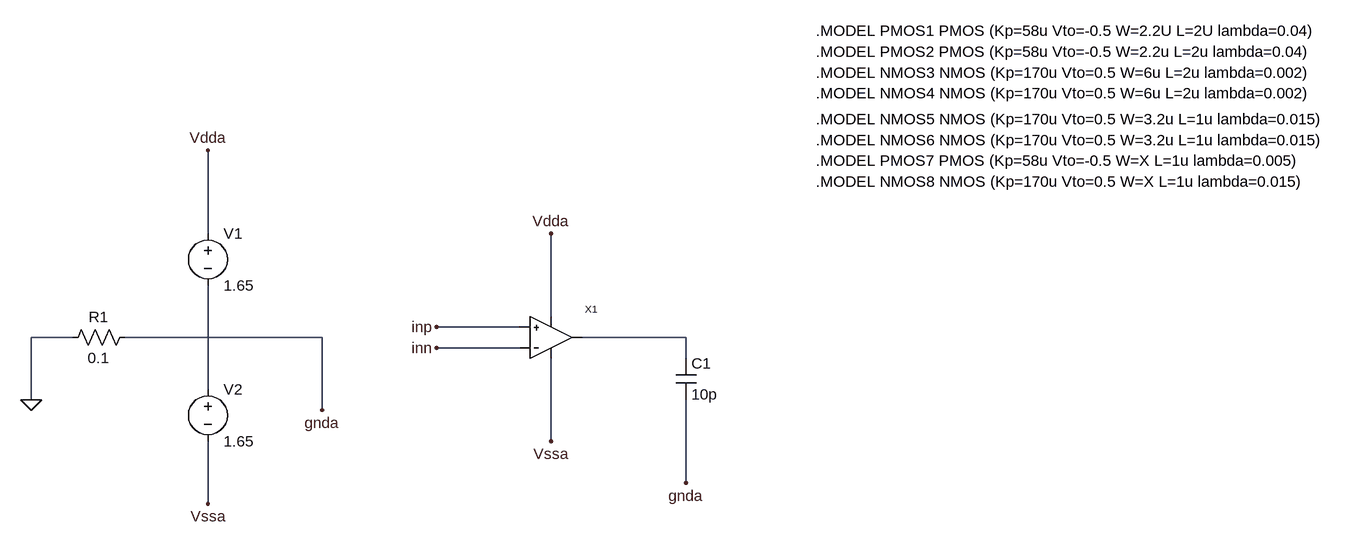
[diagram p0: schematic CMOSopamp-top.asc]
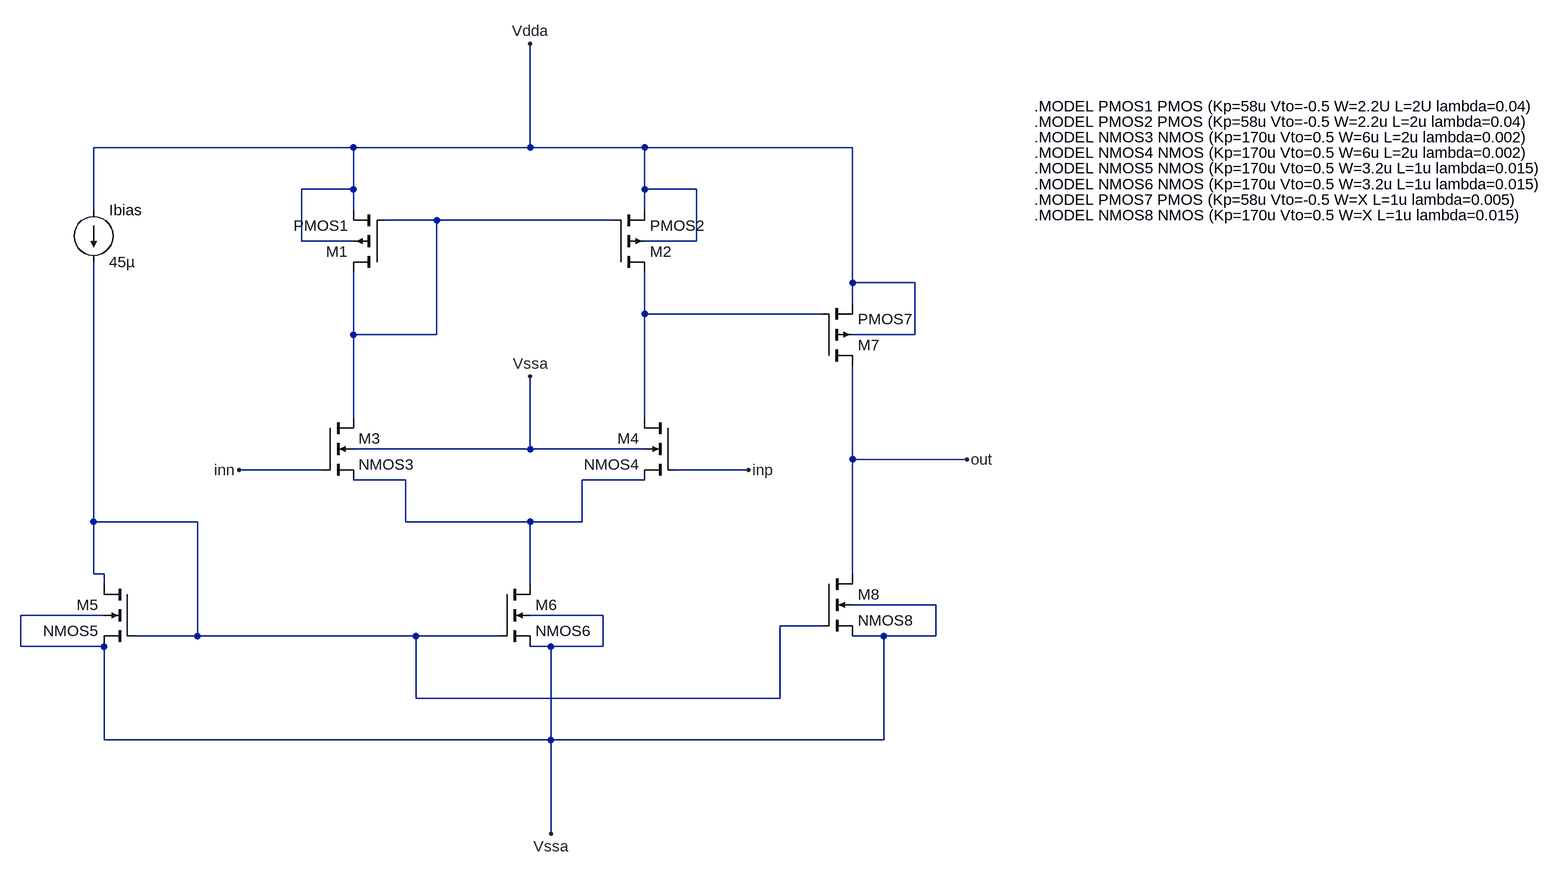
[diagram p1: sub-circuit cmosopamp.asc]
CMOSopamp-top.asc, the LTspice schematic file:
Version 4
SHEET 1 1892 680
WIRE 112 80 112 -48
WIRE 640 208 640 80
WIRE 592 224 464 224
WIRE -96 240 -160 240
WIRE 288 240 -16 240
WIRE 848 240 688 240
WIRE 592 256 464 256
WIRE 848 272 848 240
WIRE 112 320 112 160
WIRE -160 336 -160 240
WIRE 288 352 288 240
WIRE 640 400 640 272
WIRE 848 464 848 336
WIRE 112 496 112 400
FLAG -160 336 0
FLAG 288 352 gnda
FLAG 112 496 Vssa
FLAG 112 -48 Vdda
FLAG 640 80 Vdda
FLAG 464 224 inp
FLAG 464 256 inn
FLAG 640 400 Vssa
FLAG 848 464 gnda
SYMBOL voltage 112 64 R0
WINDOW 123 0 0 Left 0
WINDOW 39 0 0 Left 0
SYMATTR InstName V1
SYMATTR Value 1.65
SYMBOL voltage 112 304 R0
WINDOW 123 0 0 Left 0
WINDOW 39 0 0 Left 0
SYMATTR InstName V2
SYMATTR Value 1.65
SYMBOL res 0 224 R90
WINDOW 0 0 56 VBottom 2
WINDOW 3 32 56 VTop 2
SYMATTR InstName R1
SYMATTR Value 0.1
SYMBOL CMOSopamp 640 256 R0
SYMATTR InstName X1
SYMBOL cap 832 272 R0
SYMATTR InstName C1
SYMATTR Value 10p
TEXT 1048 -96 Left 2 !.MODEL NMOS5 NMOS (Kp=170u Vto=0.5 W=3.2u L=1u lambda=0.015)
TEXT 1048 -232 Left 2 !.MODEL PMOS1 PMOS (Kp=58u Vto=-0.5 W=2.2U L=2U lambda=0.04)
TEXT 1048 -168 Left 2 !.MODEL NMOS3 NMOS (Kp=170u Vto=0.5 W=6u L=2u lambda=0.002)
TEXT 1048 -200 Left 2 !.MODEL PMOS2 PMOS (Kp=58u Vto=-0.5 W=2.2u L=2u lambda=0.04)
TEXT 1048 -136 Left 2 !.MODEL NMOS4 NMOS (Kp=170u Vto=0.5 W=6u L=2u lambda=0.002)
TEXT 1048 -64 Left 2 !.MODEL NMOS6 NMOS (Kp=170u Vto=0.5 W=3.2u L=1u lambda=0.015)
TEXT 1048 -32 Left 2 !.MODEL PMOS7 PMOS (Kp=58u Vto=-0.5 W=X L=1u lambda=0.005)
TEXT 1048 0 Left 2 !.MODEL NMOS8 NMOS (Kp=170u Vto=0.5 W=X L=1u lambda=0.015)

cmosopamp.asc, the sub-circuit schematic file:
Version 4
SHEET 1 2232 836
WIRE -80 -320 -480 -320
WIRE 192 -320 192 -480
WIRE 192 -320 -80 -320
WIRE 368 -320 192 -320
WIRE 688 -320 368 -320
WIRE -80 -256 -80 -320
WIRE -80 -256 -160 -256
WIRE 368 -256 368 -320
WIRE 448 -256 368 -256
WIRE -480 -224 -480 -320
WIRE -80 -224 -80 -256
WIRE 368 -224 368 -256
WIRE 48 -208 -32 -208
WIRE 320 -208 48 -208
WIRE -160 -176 -160 -256
WIRE -80 -176 -160 -176
WIRE 448 -176 448 -256
WIRE 448 -176 368 -176
WIRE 688 -112 688 -320
WIRE 784 -112 688 -112
WIRE 688 -80 688 -112
WIRE 368 -64 368 -128
WIRE 640 -64 368 -64
WIRE -80 -32 -80 -128
WIRE 48 -32 48 -208
WIRE 48 -32 -80 -32
WIRE 784 -32 784 -112
WIRE 784 -32 688 -32
WIRE -80 96 -80 -32
WIRE 368 96 368 -64
WIRE 192 144 192 32
WIRE 192 144 -80 144
WIRE 368 144 192 144
WIRE 688 160 688 16
WIRE 864 160 688 160
WIRE -128 176 -256 176
WIRE 528 176 416 176
WIRE 0 192 -80 192
WIRE 368 192 272 192
WIRE -480 256 -480 -144
WIRE -320 256 -480 256
WIRE 0 256 0 192
WIRE 192 256 0 256
WIRE 272 256 272 192
WIRE 272 256 192 256
WIRE -480 336 -480 256
WIRE -464 336 -480 336
WIRE 688 336 688 160
WIRE -464 352 -464 336
WIRE 192 352 192 256
WIRE 816 384 688 384
WIRE -464 400 -592 400
WIRE 304 400 192 400
WIRE 640 416 576 416
WIRE -320 432 -320 256
WIRE -320 432 -416 432
WIRE 16 432 -320 432
WIRE 144 432 16 432
WIRE 736 432 688 432
WIRE 816 432 816 384
WIRE 816 432 736 432
WIRE -592 448 -592 400
WIRE -464 448 -592 448
WIRE 224 448 192 448
WIRE 304 448 304 400
WIRE 304 448 224 448
WIRE 16 528 16 432
WIRE 576 528 576 416
WIRE 576 528 16 528
WIRE -464 592 -464 448
WIRE 224 592 224 448
WIRE 224 592 -464 592
WIRE 736 592 736 432
WIRE 736 592 224 592
WIRE 224 736 224 592
FLAG 192 -480 Vdda
FLAG 224 736 Vssa
FLAG 192 32 Vssa
FLAG 528 176 inp
FLAG 864 160 out
FLAG -256 176 inn
SYMBOL nmos4 416 96 M0
SYMATTR InstName M4
SYMATTR Value NMOS4
SYMBOL nmos4 -128 96 R0
SYMATTR InstName M3
SYMATTR Value NMOS3
SYMBOL nmos4 144 352 R0
SYMATTR InstName M6
SYMATTR Value NMOS6
SYMBOL current -480 -224 R0
WINDOW 123 0 0 Left 0
WINDOW 39 0 0 Left 0
SYMATTR InstName Ibias
SYMATTR Value 45µ
SYMBOL pmos4 -32 -128 R180
SYMATTR InstName M1
SYMATTR Value PMOS1
SYMBOL pmos4 320 -128 M180
SYMATTR InstName M2
SYMATTR Value PMOS2
SYMBOL pmos4 640 16 M180
SYMATTR InstName M7
SYMATTR Value PMOS7
SYMBOL nmos4 640 336 R0
SYMATTR InstName M8
SYMATTR Value NMOS8
SYMBOL nmos4 -416 352 M0
SYMATTR InstName M5
SYMATTR Value NMOS5
TEXT 968 -384 Left 2 !.MODEL PMOS1 PMOS (Kp=58u Vto=-0.5 W=2.2U L=2U lambda=0.04)
TEXT 968 -360 Left 2 !.MODEL PMOS2 PMOS (Kp=58u Vto=-0.5 W=2.2u L=2u lambda=0.04)
TEXT 968 -336 Left 2 !.MODEL NMOS3 NMOS (Kp=170u Vto=0.5 W=6u L=2u lambda=0.002)
TEXT 968 -312 Left 2 !.MODEL NMOS4 NMOS (Kp=170u Vto=0.5 W=6u L=2u lambda=0.002)
TEXT 968 -288 Left 2 !.MODEL NMOS5 NMOS (Kp=170u Vto=0.5 W=3.2u L=1u lambda=0.015)
TEXT 968 -264 Left 2 !.MODEL NMOS6 NMOS (Kp=170u Vto=0.5 W=3.2u L=1u lambda=0.015)
TEXT 968 -240 Left 2 !.MODEL PMOS7 PMOS (Kp=58u Vto=-0.5 W=X L=1u lambda=0.005)
TEXT 968 -216 Left 2 !.MODEL NMOS8 NMOS (Kp=170u Vto=0.5 W=X L=1u lambda=0.015)

The netlist it stands for:
* CMOSopamp-top.asc
V1 Vdda N002 1.65
V2 N002 Vssa 1.65
R1 gnda 0 0.1
XX1 Vdda N001 inp inn Vssa cmosopamp
C1 N001 gnda 10p

* block symbol definitions
.subckt cmosopamp Vdda out inp inn Vssa
M4 N002 inp N003 Vssa NMOS4
M3 N001 inn N003 Vssa NMOS3
M6 N003 N004 Vssa Vssa NMOS6
Ibias Vdda N004 45µ
M1 N001 N001 Vdda Vdda PMOS1
M2 N002 N001 Vdda Vdda PMOS2
M7 out N002 Vdda Vdda PMOS7
M8 out N004 Vssa Vssa NMOS8
M5 N004 N004 Vssa Vssa NMOS5
.MODEL PMOS1 PMOS (Kp=58u Vto=-0.5 W=2.2U L=2U lambda=0.04)
.MODEL PMOS2 PMOS (Kp=58u Vto=-0.5 W=2.2u L=2u lambda=0.04)
.MODEL NMOS3 NMOS (Kp=170u Vto=0.5 W=6u L=2u lambda=0.002)
.MODEL NMOS4 NMOS (Kp=170u Vto=0.5 W=6u L=2u lambda=0.002)
.MODEL NMOS5 NMOS (Kp=170u Vto=0.5 W=3.2u L=1u lambda=0.015)
.MODEL NMOS6 NMOS (Kp=170u Vto=0.5 W=3.2u L=1u lambda=0.015)
.MODEL PMOS7 PMOS (Kp=58u Vto=-0.5 W=X L=1u lambda=0.005)
.MODEL NMOS8 NMOS (Kp=170u Vto=0.5 W=X L=1u lambda=0.015)
.ends cmosopamp

.model NMOS NMOS
.model PMOS PMOS
.lib standard.mos
.MODEL NMOS5 NMOS (Kp=170u Vto=0.5 W=3.2u L=1u lambda=0.015)
.MODEL PMOS1 PMOS (Kp=58u Vto=-0.5 W=2.2U L=2U lambda=0.04)
.MODEL NMOS3 NMOS (Kp=170u Vto=0.5 W=6u L=2u lambda=0.002)
.MODEL PMOS2 PMOS (Kp=58u Vto=-0.5 W=2.2u L=2u lambda=0.04)
.MODEL NMOS4 NMOS (Kp=170u Vto=0.5 W=6u L=2u lambda=0.002)
.MODEL NMOS6 NMOS (Kp=170u Vto=0.5 W=3.2u L=1u lambda=0.015)
.MODEL PMOS7 PMOS (Kp=58u Vto=-0.5 W=X L=1u lambda=0.005)
.MODEL NMOS8 NMOS (Kp=170u Vto=0.5 W=X L=1u lambda=0.015)
.backanno
.end